# EAGLE design Adafruit Pi SD Card Adapter (EAGLE 6.2)
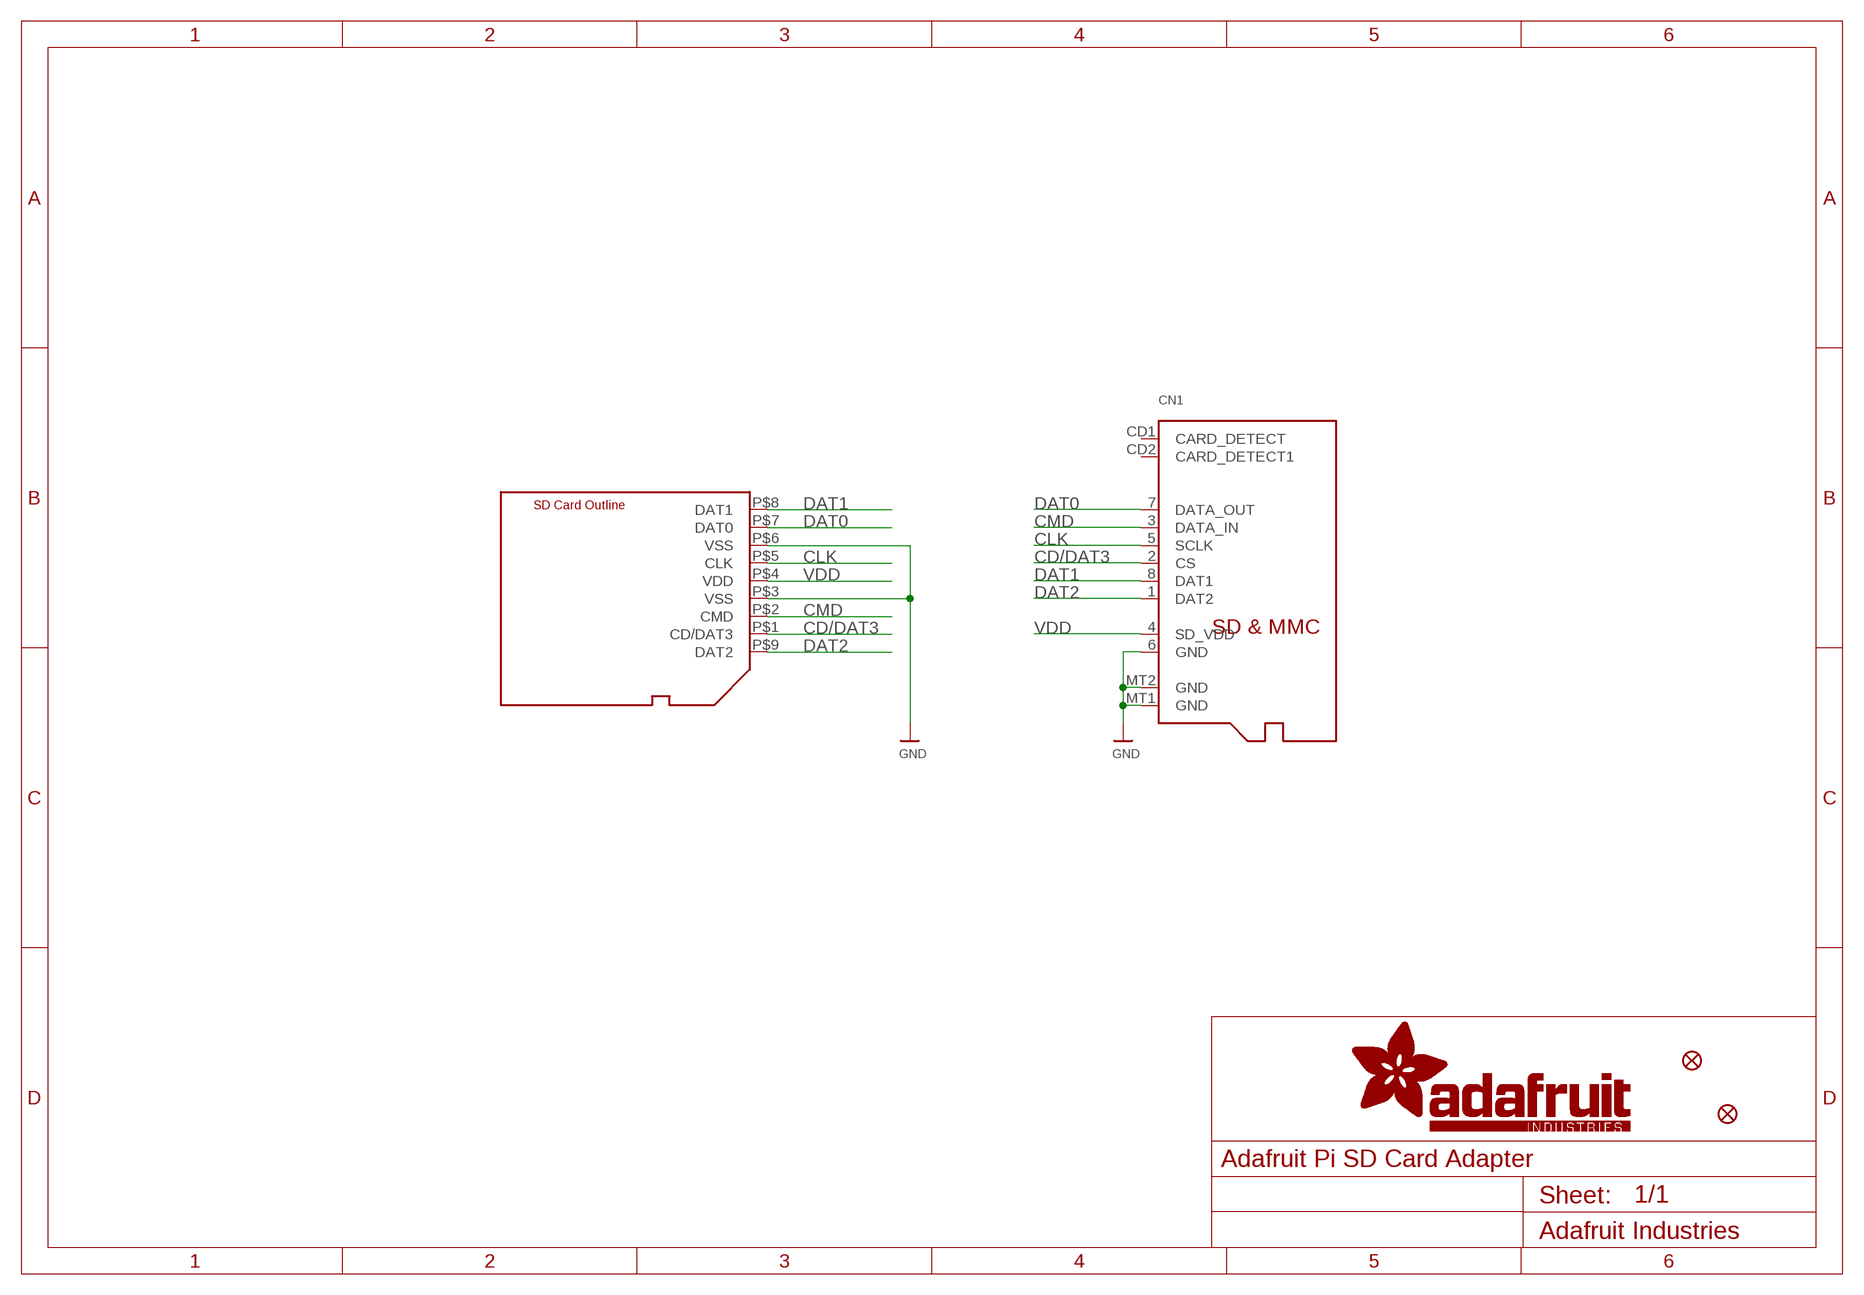
[diagram p0: schematic, sheet 1]

## Parts
CN1  MICROSD  [MICROSD]
FID1  FIDUCIAL1X2.5  [FIDUCIAL-1X2.5]
FID2  FIDUCIAL1X2.5  [FIDUCIAL-1X2.5]
U$2  SDCARD_PCBCARRIERTDOCU  [SDCARD_PCBCARRIER_DOCU]

## Nets
CD/DAT3: CN1.2(CS) U$2.P$1(CD/DAT3)
CLK: CN1.5(SCLK) U$2.P$5(CLK)
CMD: CN1.3(DATA_IN) U$2.P$2(CMD)
DAT0: CN1.7(DATA_OUT) U$2.P$7(DAT0)
DAT1: CN1.8(DAT1) U$2.P$8(DAT1)
DAT2: CN1.1(DAT2) U$2.P$9(DAT2)
GND: CN1.6(GND) CN1.MT1(GND) CN1.MT2(GND) U$2.P$3(VSS) U$2.P$6(VSS)
VDD: CN1.4(SD_VDD) U$2.P$4(VDD)
Unconnected: CN1.CD1(CARD_DETECT) CN1.CD2(CARD_DETECT1)

## Library data of the parts
CN1 = microbuilder:MICROSD: MicroSD/Transflash Card Holder with SPI pinout 3M: 2908-05WB-M6 4UConnector: 19656 Footprint courtesy: Adafruit Industries
FID1 FID2 = microbuilder:FIDUCIAL: Fiducial Alignment Points Various fiducial points for machine vision alignment.
U$2 = microbuilder:SDCARD_PCBCARRIER: Physical PCB representing an SD Card

## Board
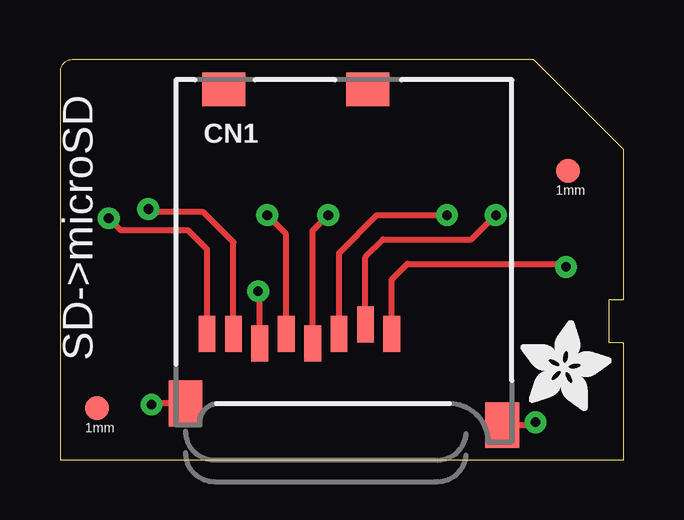
[diagram p1: board, top side]
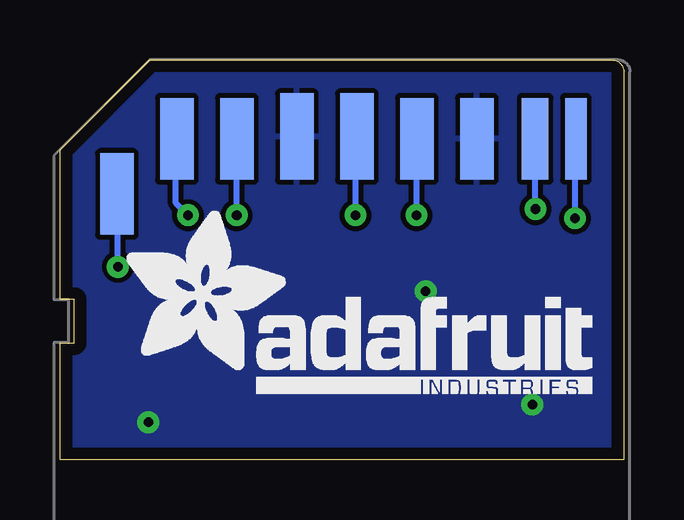
[diagram p2: board, bottom side, seen from below]

Size 23.49 x 16.69 mm. Coordinates in mm from the lower left corner, seen from the top.
Outline: 0,0 23.49,0 23.49,4.89 22.89,4.89 22.89,6.69 23.49,6.69 23.49,12.94 19.75,16.69 0.5,16.69 arc90 0,16.19 0,0
Copper layers (1*16): Top 0.035mm / dielectric 1.5mm / Bottom 0.035mm
Design rules "default": minimum track width 8mil, minimum drill 0.4mm, track to track 8mil, track to pad 8mil, pad to pad 8mil, via to via 8mil, smd to smd 8mil, copper to edge 20mil, drill to drill 8mil, minimum pad ring 8mil, minimum via ring 10mil, stop-mask expansion 3mil, vias tented up to drill 20mil, thermal gap 8mil

### Footprints (pad centres in the part's own frame; a part is rotated, then mirrored left to right if it is on the bottom)
MICROSD = smd 0.7 x 1.5: 1 9,-10.64; 2 7.9,-10.24; 3 6.8,-10.64; 4 5.7,-11.04; 5 4.6,-10.64; 6 3.5,-11.04; 7 2.4,-10.64; 8 1.3,-10.64 | smd 1.8 x 1.4: CD1 2,-0.44; CD2 8,-0.44 | smd 1.4 x 1.9: MT1 0.4,-13.54; MT2 13.6,-14.44
FIDUCIAL-1X2.5 = smd 1 x 1: 1 0,0
SDCARD_PCBCARRIER_DOCU = smd 1.4 x 3.4: P$1 -6.875,0; P$2 -4.375,0; P$5 3.125,0; P$6 5.625,0; P$9 -9.375,-2.3 | smd 1.4 x 3.6: P$3 -1.875,0.1; P$4 0.625,0.1 | smd 1.1 x 3.4: P$7 8.05,0 | smd 0.9 x 3.4: P$8 9.75,0

### Placement (x,y rotation side)
CN1  4.83,15.9 0 top
FID1  21.16,12.07 0 top
FID2  1.55,2.16 0 top
U$2  11.75,13.4 0 bottom
U$5  [ADAFRUIT_3.5MM]  19.18,2.04 0 top
U$6  [ADAFRUIT_TEXT_20MM]  20.88,2.77 0 bottom

### Tracks (layer width: path | path; a pad name or v marks a point on that pad's centre or on a via)
CD/DAT3  (via drill 0.4)
  Top 0.254: CN1.2 12.73,8.46 13.46,9.2 17.14,9.2 v18.16,10.21
  Bottom 0.254: v18.16,10.21 18.67,10.72 18.67,13.35 U$2.P$1
CLK  (via drill 0.4)
  Top 0.254: CN1.5 9.43,9.42 v8.64,10.21
  Bottom 0.254: v8.64,10.21 8.64,13.38 U$2.P$5
CMD  (via drill 0.4)
  Top 0.254: CN1.3 11.63,8.63 13.21,10.21 v16.13,10.21
  Bottom 0.254: v16.13,10.21 16.13,13.39 U$2.P$2
DAT0  (via drill 0.4)
  Top 0.254: CN1.7 7.23,9.08 5.97,10.34 3.81,10.34 v3.68,10.47
  Bottom 0.254: v3.68,10.47 3.68,13.38 U$2.P$7
DAT1  (via drill 0.4)
  Top 0.254: CN1.8 6.13,8.79 5.33,9.58 2.54,9.58 v2.03,10.09
  Bottom 0.254: v2.03,10.09 2.03,13.36 U$2.P$8
DAT2  (via drill 0.4)
  Top 0.254: CN1.1 13.83,7.53 14.48,8.18 20.7,8.18 v21.08,8.06
  Bottom 0.254: v21.08,8.06 21.08,11.06 U$2.P$9
GND  (via drill 0.4 pad 0.25)
  Top 0.254: CN1.6 8.33,6.97 v8.26,7.04 | CN1.MT2 19.7,1.46 v19.81,1.58 | CN1.MT1 3.88,2.36 v3.81,2.32
  Bottom 0.254: v8.26,7.04 8.26,7.29 | v19.81,1.58 20.07,1.58 | v3.81,2.32 3.53,2.32
  pour Bottom: 0,0.05 23.49,0.05 23.49,4.88 22.86,4.88 22.86,6.66 23.49,6.66 23.49,12.75 19.81,16.69 0.51,16.69 arc90 0,16.18
VDD  (via drill 0.4)
  Top 0.254: CN1.4 10.53,9.56 v11.18,10.21
  Bottom 0.254: v11.18,10.21 11.18,13.44 U$2.P$4

### Text on the board
tPlace: SD->microSD